# EAGLE schematic LEDs (EAGLE 7.7.0)
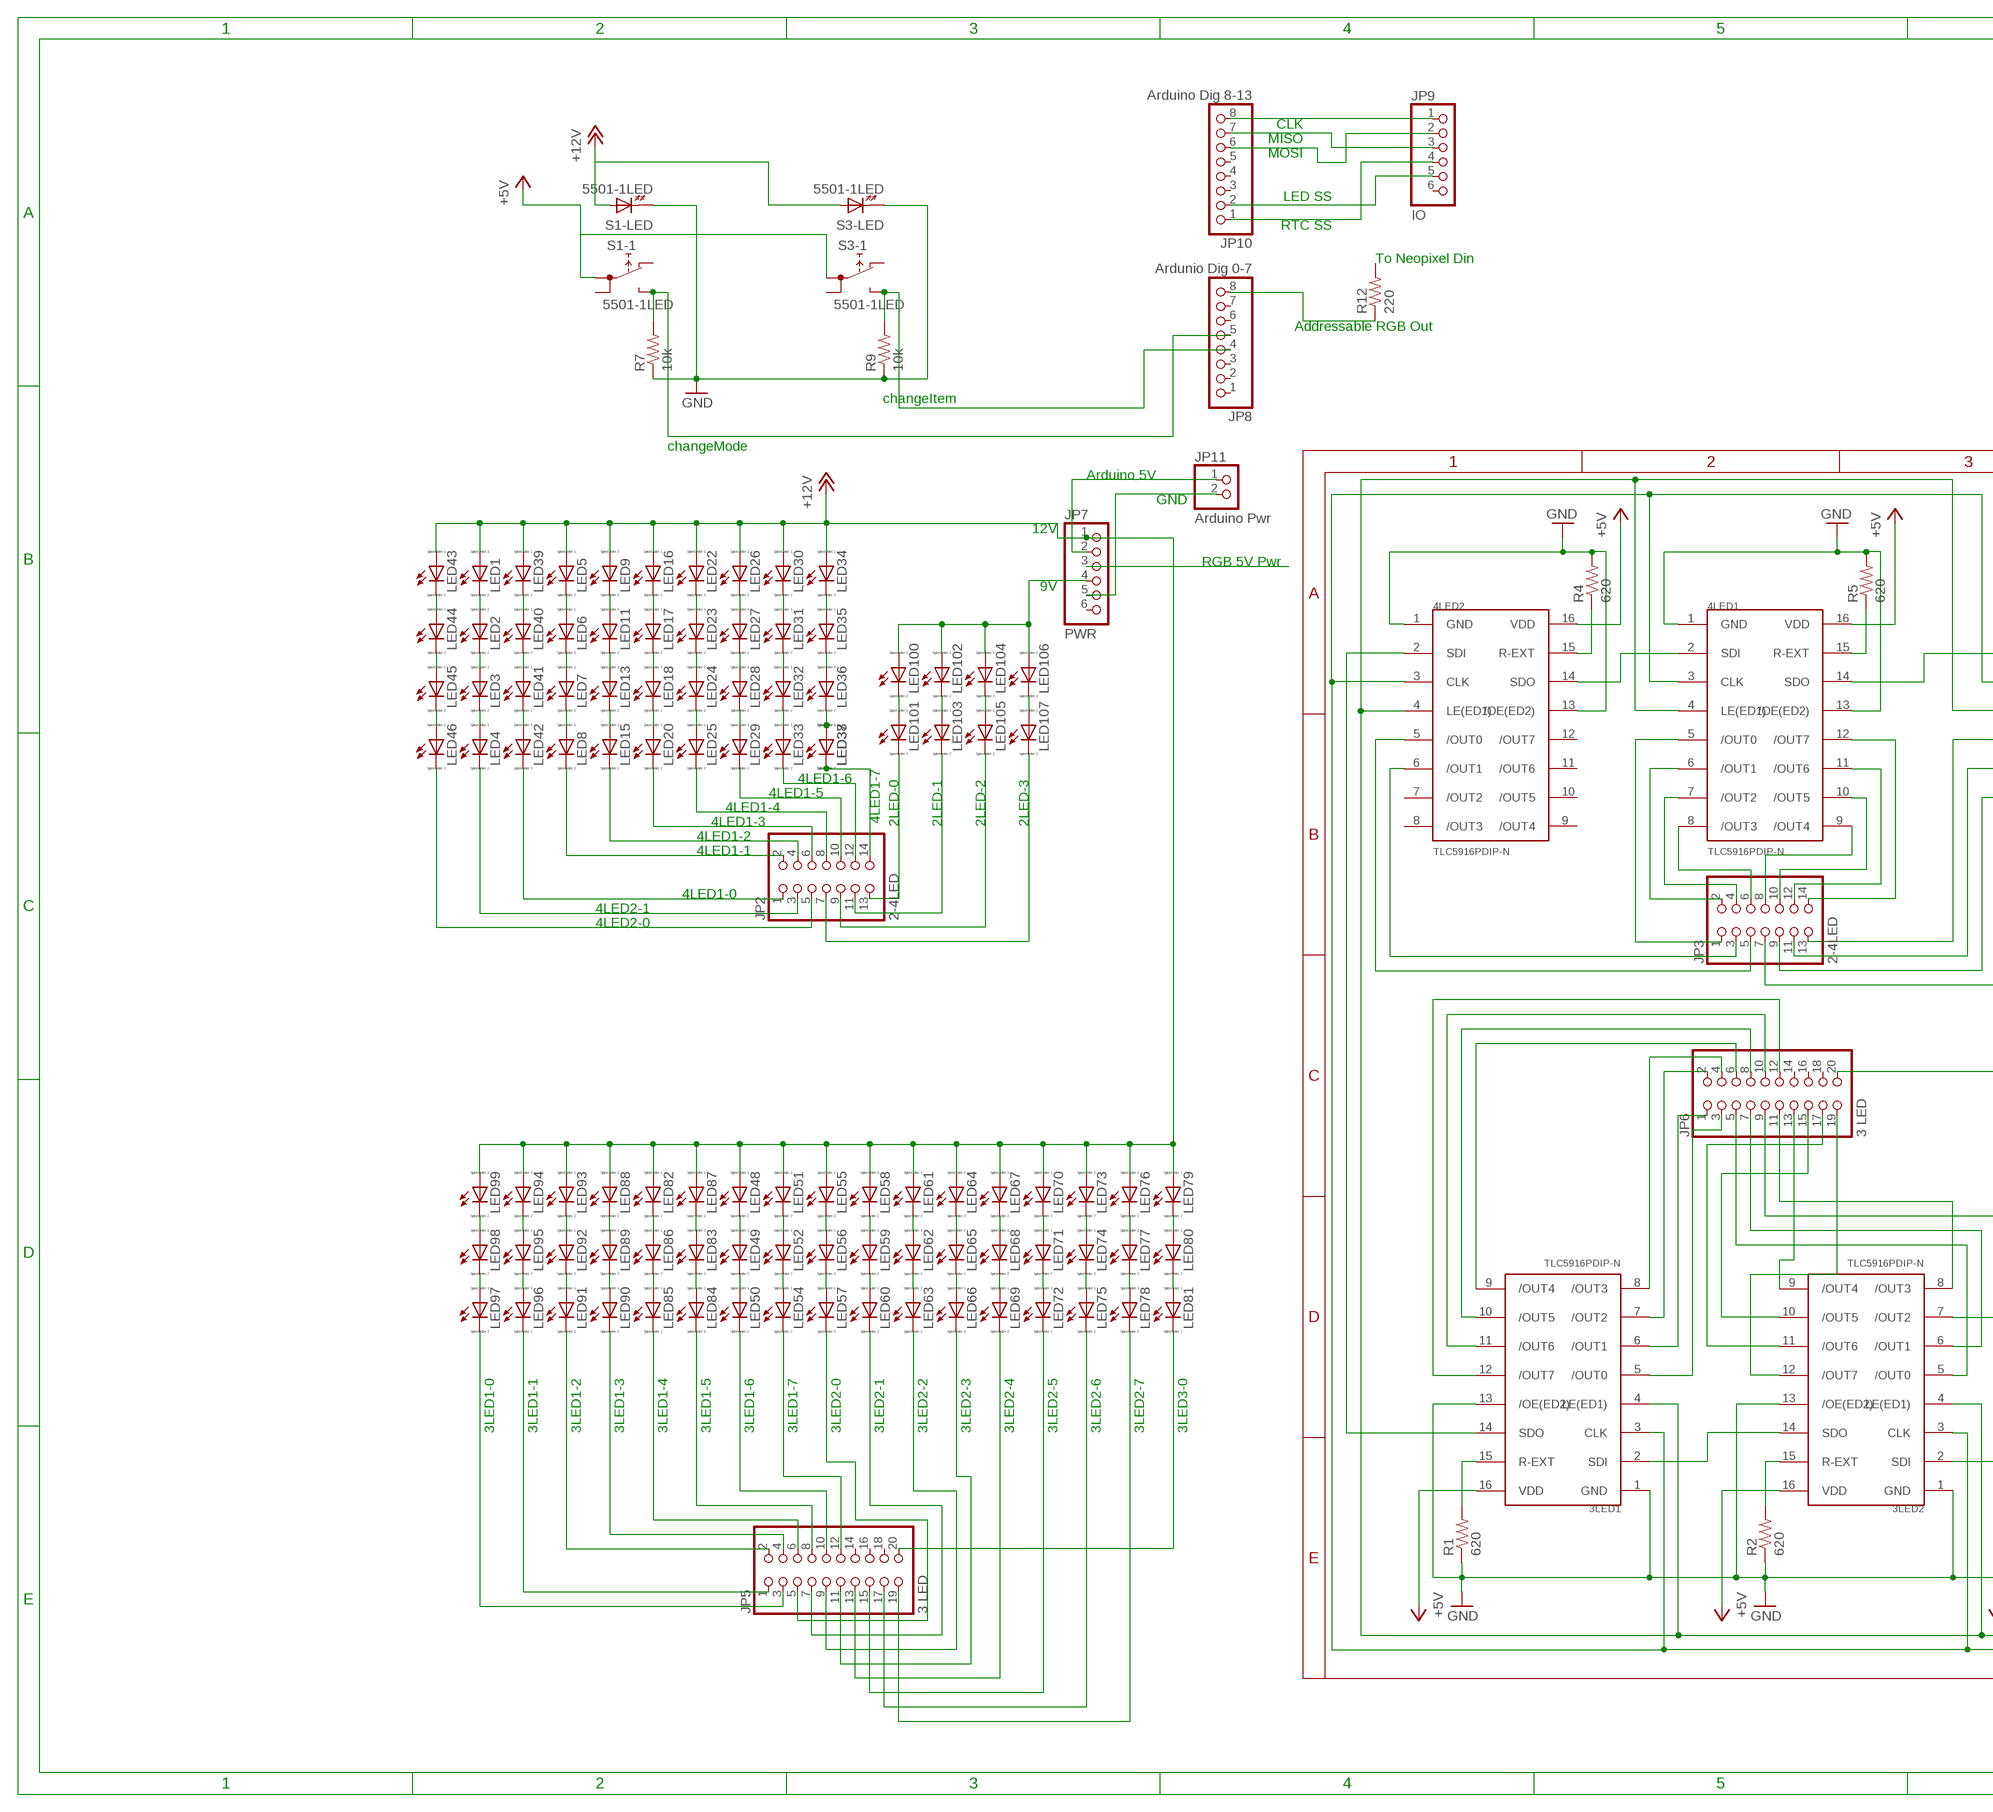
[diagram p0: schematic, sheet 1, part 1 of 2]
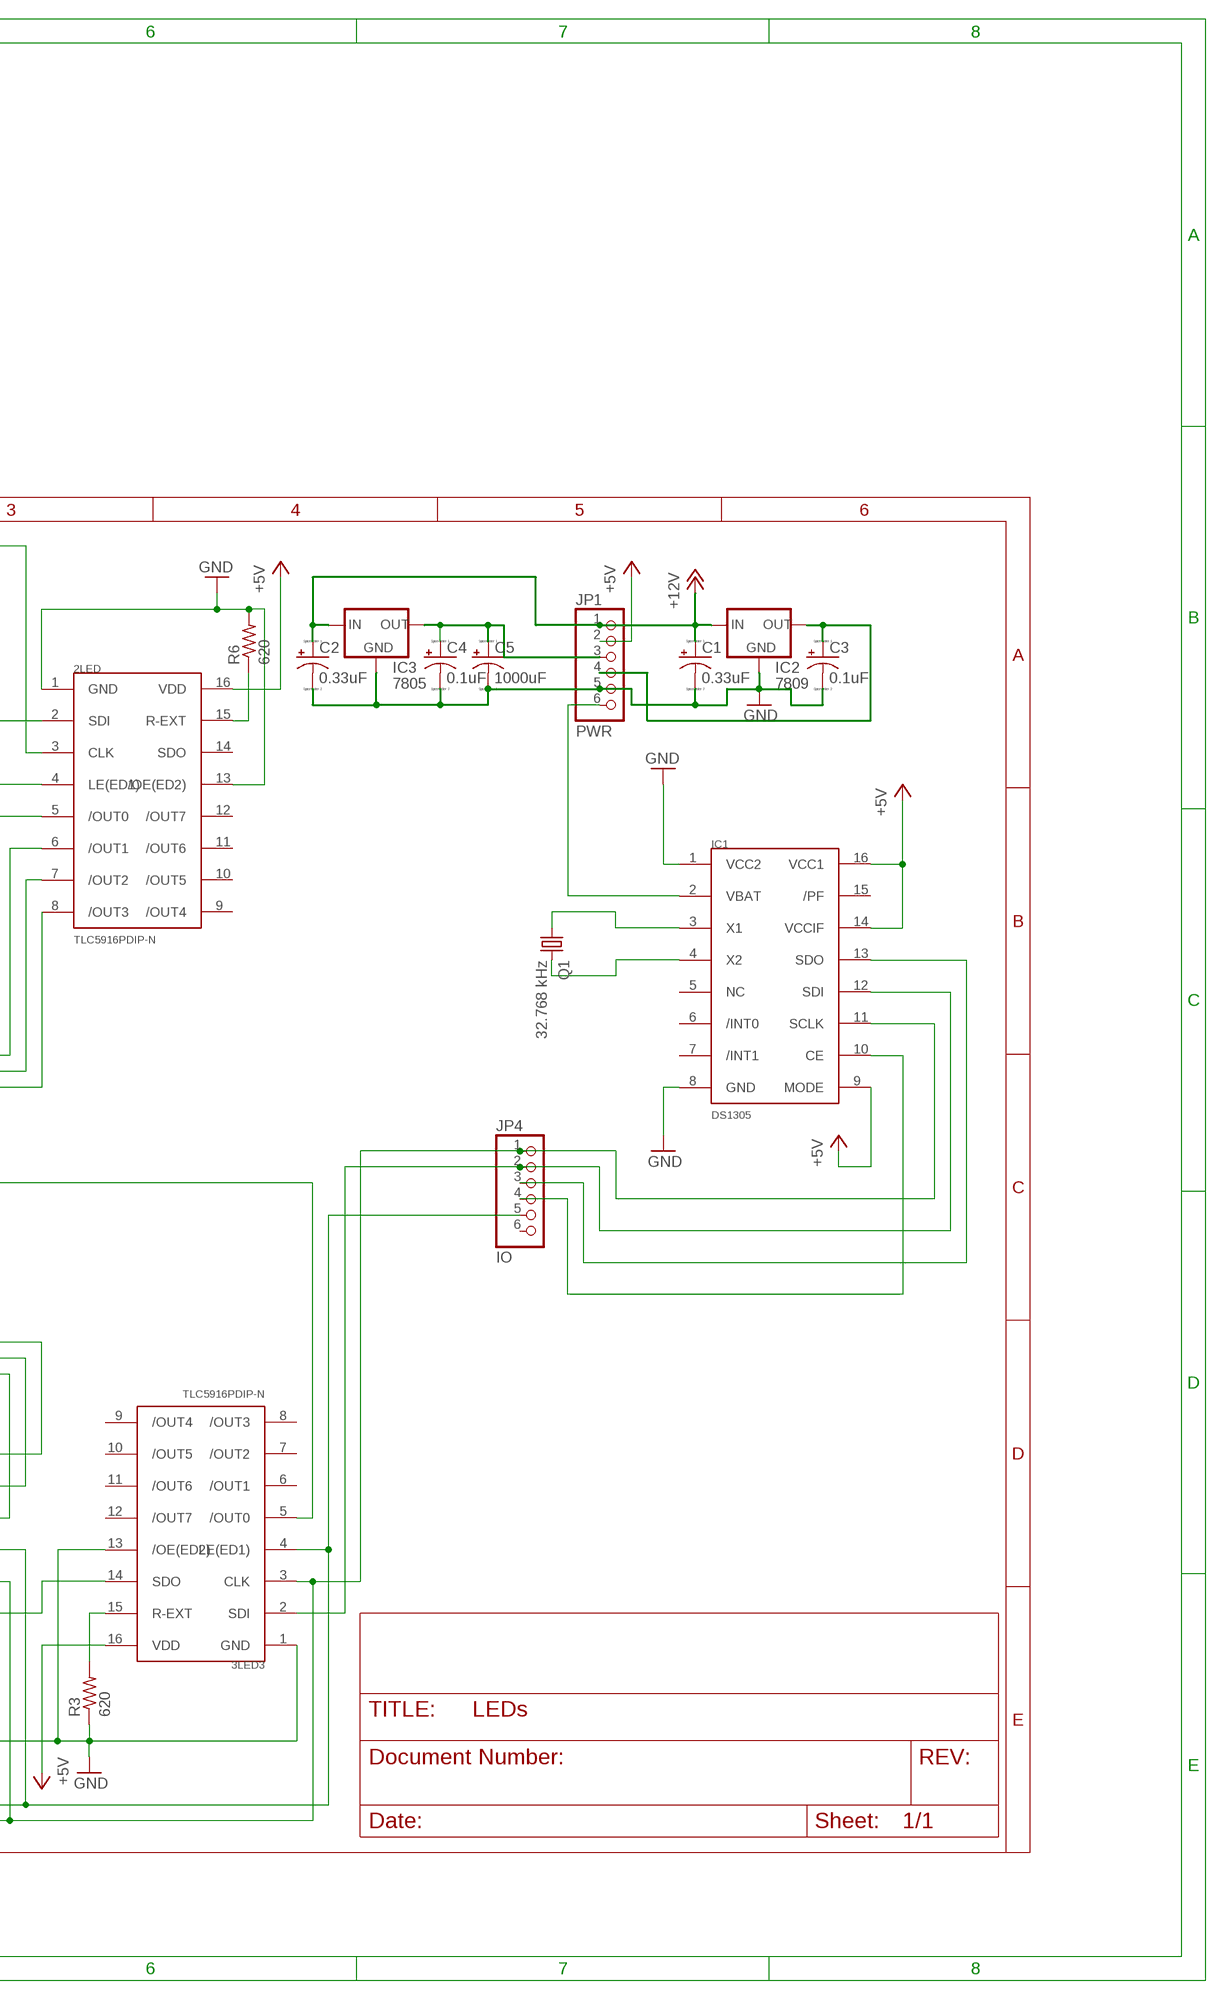
[diagram p1: schematic, sheet 1, part 2 of 2]

## Parts
2LED  TLC5916PDIP-N  [DIL16]
3LED1  TLC5916PDIP-N  [DIL16]
3LED2  TLC5916PDIP-N  [DIL16]
3LED3  TLC5916PDIP-N  [DIL16]
4LED1  TLC5916PDIP-N  [DIL16]
4LED2  TLC5916PDIP-N  [DIL16]
C1  0.33uF  CPOL-USE2-4  [E2-4]
C2  0.33uF  CPOL-USE2-4  [E2-4]
C3  0.1uF  CPOL-USE2-4  [E2-4]
C4  0.1uF  CPOL-USE2-4  [E2-4]
C5  1000uF  CPOL-USE3.5-8  [E3,5-8]
IC1  DS1305  [DIL16]
IC2  7809  78XXL  [78XXL]
IC3  7805  78XXL  [78XXL]
JP1  PWR  PINHD-1X6  [1X06]
JP2  2-4LED  PINHD-2X7  [2X07]
JP3  2-4LED  PINHD-2X7  [2X07]
JP4  IO  PINHD-1X6  [1X06]
JP5  3 LED  PINHD-2X10  [2X10]
JP6  3 LED  PINHD-2X10  [2X10]
JP7  PWR  PINHD-1X6  [1X06]
JP8  Ardunio Dig 0-7  PINHD-1X8  [1X08]
JP9  IO  PINHD-1X6  [1X06]
JP10  Arduino Dig 8-13  PINHD-1X8  [1X08]
JP11  Arduino Pwr  PINHD-1X2  [1X02]
LED1  LED_ELD260  [LED_LD260]
LED2  LED_ELD260  [LED_LD260]
LED3  LED_ELD260  [LED_LD260]
LED4  LED_ELD260  [LED_LD260]
LED5  LED_ELD260  [LED_LD260]
LED6  LED_ELD260  [LED_LD260]
LED7  LED_ELD260  [LED_LD260]
LED8  LED_ELD260  [LED_LD260]
LED9  LED_ELD260  [LED_LD260]
LED11  LED_ELD260  [LED_LD260]
LED13  LED_ELD260  [LED_LD260]
LED15  LED_ELD260  [LED_LD260]
LED16  LED_ELD260  [LED_LD260]
LED17  LED_ELD260  [LED_LD260]
LED18  LED_ELD260  [LED_LD260]
LED20  LED_ELD260  [LED_LD260]
LED22  LED_ELD260  [LED_LD260]
LED23  LED_ELD260  [LED_LD260]
LED24  LED_ELD260  [LED_LD260]
LED25  LED_ELD260  [LED_LD260]
LED26  LED_ELD260  [LED_LD260]
LED27  LED_ELD260  [LED_LD260]
LED28  LED_ELD260  [LED_LD260]
LED29  LED_ELD260  [LED_LD260]
LED30  LED_ELD260  [LED_LD260]
LED31  LED_ELD260  [LED_LD260]
LED32  LED_ELD260  [LED_LD260]
LED33  LED_ELD260  [LED_LD260]
LED34  LED_ELD260  [LED_LD260]
LED35  LED_ELD260  [LED_LD260]
LED36  LED_ELD260  [LED_LD260]
LED37  LED_ELD260  [LED_LD260]
LED38  LED_ELD260  [LED_LD260]
LED39  LED_ELD260  [LED_LD260]
LED40  LED_ELD260  [LED_LD260]
LED41  LED_ELD260  [LED_LD260]
LED42  LED_ELD260  [LED_LD260]
LED43  LED_ELD260  [LED_LD260]
LED44  LED_ELD260  [LED_LD260]
LED45  LED_ELD260  [LED_LD260]
LED46  LED_ELD260  [LED_LD260]
LED48  LED_ELD260  [LED_LD260]
LED49  LED_ELD260  [LED_LD260]
LED50  LED_ELD260  [LED_LD260]
LED51  LED_ELD260  [LED_LD260]
LED52  LED_ELD260  [LED_LD260]
LED54  LED_ELD260  [LED_LD260]
LED55  LED_ELD260  [LED_LD260]
LED56  LED_ELD260  [LED_LD260]
LED57  LED_ELD260  [LED_LD260]
LED58  LED_ELD260  [LED_LD260]
LED59  LED_ELD260  [LED_LD260]
LED60  LED_ELD260  [LED_LD260]
LED61  LED_ELD260  [LED_LD260]
LED62  LED_ELD260  [LED_LD260]
LED63  LED_ELD260  [LED_LD260]
LED64  LED_ELD260  [LED_LD260]
LED65  LED_ELD260  [LED_LD260]
LED66  LED_ELD260  [LED_LD260]
LED67  LED_ELD260  [LED_LD260]
LED68  LED_ELD260  [LED_LD260]
LED69  LED_ELD260  [LED_LD260]
LED70  LED_ELD260  [LED_LD260]
LED71  LED_ELD260  [LED_LD260]
LED72  LED_ELD260  [LED_LD260]
LED73  LED_ELD260  [LED_LD260]
LED74  LED_ELD260  [LED_LD260]
LED75  LED_ELD260  [LED_LD260]
LED76  LED_ELD260  [LED_LD260]
LED77  LED_ELD260  [LED_LD260]
LED78  LED_ELD260  [LED_LD260]
LED79  LED_ELD260  [LED_LD260]
LED80  LED_ELD260  [LED_LD260]
LED81  LED_ELD260  [LED_LD260]
LED82  LED_ELD260  [LED_LD260]
LED83  LED_ELD260  [LED_LD260]
LED84  LED_ELD260  [LED_LD260]
LED85  LED_ELD260  [LED_LD260]
LED86  LED_ELD260  [LED_LD260]
LED87  LED_ELD260  [LED_LD260]
LED88  LED_ELD260  [LED_LD260]
LED89  LED_ELD260  [LED_LD260]
LED90  LED_ELD260  [LED_LD260]
LED91  LED_ELD260  [LED_LD260]
LED92  LED_ELD260  [LED_LD260]
LED93  LED_ELD260  [LED_LD260]
LED94  LED_ELD260  [LED_LD260]
LED95  LED_ELD260  [LED_LD260]
LED96  LED_ELD260  [LED_LD260]
LED97  LED_ELD260  [LED_LD260]
LED98  LED_ELD260  [LED_LD260]
LED99  LED_ELD260  [LED_LD260]
LED100  LED_ELD260  [LED_LD260]
LED101  LED_ELD260  [LED_LD260]
LED102  LED_ELD260  [LED_LD260]
LED103  LED_ELD260  [LED_LD260]
LED104  LED_ELD260  [LED_LD260]
LED105  LED_ELD260  [LED_LD260]
LED106  LED_ELD260  [LED_LD260]
LED107  LED_ELD260  [LED_LD260]
Q1  32.768 kHz  CRYSTALTC26V  [TC26V]
R1  620  R-US_V235/17  [V235/17]
R2  620  R-US_V235/17  [V235/17]
R3  620  R-US_V235/17  [V235/17]
R4  620  R-US_V235/17  [V235/17]
R5  620  R-US_V235/17  [V235/17]
R6  620  R-US_V235/17  [V235/17]
R7  10k  R-US_0204/7  [0204/7]
R9  10k  R-US_0204/7  [0204/7]
R12  220  R-US_0204/7  [0204/7]
S1  5501-1LED  [5501-1LED]
S3  5501-1LED  [5501-1LED]

## Nets
+5V: 2LED.16(VDD) 3LED1.16(VDD) 3LED2.16(VDD) 3LED3.16(VDD) 4LED1.16(VDD) 4LED2.16(VDD) IC1.9(MODE) IC1.14(VCCIF) IC1.16(VCC1) JP1.2 S1.1A(-1:1A) S3.1A(-1:1A)
+12V: C1.+ C2.+ IC2.IN IC3.IN JP1.1 JP7.1 LED1.A LED5.A LED9.A LED16.A LED22.A LED26.A LED30.A LED34.A LED39.A LED43.A LED48.A LED51.A LED55.A LED58.A LED61.A LED64.A LED67.A LED70.A LED73.A LED76.A LED79.A LED82.A LED87.A LED88.A LED93.A LED94.A LED99.A S1.+(-LED:A) S3.+(-LED:A)
GND: 2LED.1(GND) 2LED.13(/OE(ED2)) 3LED1.1(GND) 3LED1.13(/OE(ED2)) 3LED2.1(GND) 3LED2.13(/OE(ED2)) 3LED3.1(GND) 3LED3.13(/OE(ED2)) 4LED1.1(GND) 4LED1.13(/OE(ED2)) 4LED2.1(GND) 4LED2.13(/OE(ED2)) C1.- C2.- C3.- C4.- C5.- IC1.1(VCC2) IC1.8(GND) IC2.GND IC3.GND JP1.5 R1.1 R2.1 R3.1 R4.2 R5.2 R6.2 R7.1 R9.1 S1.-(-LED:K) S3.-(-LED:K)
MISO: IC1.13(SDO) JP4.3
MOSI: 3LED3.2(SDI) IC1.12(SDI) JP4.2
N$1: IC1.3(X1) Q1.1
N$2: IC1.4(X2) Q1.2
N$3: LED95.K(C) LED96.A
N$4: LED94.K(C) LED95.A
N$5: LED92.A LED93.K(C)
N$6: LED91.A LED92.K(C)
N$7: LED100.K(C) LED101.A
N$8: LED102.K(C) LED103.A
N$9: LED36.K(C) LED37.A LED38.A
N$10: JP2.14 LED37.K(C) LED38.K(C)
N$11: LED104.K(C) LED105.A
N$12: LED106.K(C) LED107.A
N$13: LED34.K(C) LED35.A
N$14: LED30.K(C) LED31.A
N$15: LED26.K(C) LED27.A
N$16: LED22.K(C) LED23.A
N$17: LED16.K(C) LED17.A
N$18: LED9.K(C) LED11.A
N$19: LED5.K(C) LED6.A
N$20: LED39.K(C) LED40.A
N$21: LED1.K(C) LED2.A
N$22: LED43.K(C) LED44.A
N$23: LED44.K(C) LED45.A
N$24: LED2.K(C) LED3.A
N$25: LED40.K(C) LED41.A
N$26: LED6.K(C) LED7.A
N$27: LED11.K(C) LED13.A
N$28: LED17.K(C) LED18.A
N$29: LED23.K(C) LED24.A
N$30: LED27.K(C) LED28.A
N$31: LED31.K(C) LED32.A
N$32: LED35.K(C) LED36.A
N$33: LED32.K(C) LED33.A
N$34: LED28.K(C) LED29.A
N$35: LED24.K(C) LED25.A
N$36: LED18.K(C) LED20.A
N$37: LED13.K(C) LED15.A
N$38: LED7.K(C) LED8.A
N$39: LED41.K(C) LED42.A
N$40: LED3.K(C) LED4.A
N$41: LED45.K(C) LED46.A
N$42: C4.+ C5.+ IC3.OUT JP1.3
N$43: LED98.A LED99.K(C)
N$44: LED97.A LED98.K(C)
N$45: LED89.K(C) LED90.A
N$46: LED88.K(C) LED89.A
N$47: LED82.K(C) LED86.A
N$48: LED85.A LED86.K(C)
N$49: LED83.K(C) LED84.A
N$50: LED83.A LED87.K(C)
N$51: LED48.K(C) LED49.A
N$52: LED49.K(C) LED50.A
N$53: LED52.K(C) LED54.A
N$54: LED56.K(C) LED57.A
N$55: LED55.K(C) LED56.A
N$56: LED51.K(C) LED52.A
N$57: LED58.K(C) LED59.A
N$58: LED59.K(C) LED60.A
N$59: LED62.K(C) LED63.A
N$60: LED61.K(C) LED62.A
N$61: LED64.K(C) LED65.A
N$62: LED65.K(C) LED66.A
N$63: LED68.K(C) LED69.A
N$64: LED71.K(C) LED72.A
N$65: LED74.K(C) LED75.A
N$66: LED77.K(C) LED78.A
N$67: LED80.K(C) LED81.A
N$68: LED79.K(C) LED80.A
N$69: LED76.K(C) LED77.A
N$70: LED73.K(C) LED74.A
N$71: LED70.K(C) LED71.A
N$72: LED67.K(C) LED68.A
N$73: C3.+ IC2.OUT JP1.4
N$74: IC1.2(VBAT) JP1.6
N$75: 2LED.5(/OUT0) JP3.13
N$76: 2LED.6(/OUT1) JP3.11
N$77: 2LED.7(/OUT2) JP3.9
N$78: 2LED.8(/OUT3) JP3.7
N$79: 4LED1.12(/OUT7) JP3.14
N$80: 4LED1.11(/OUT6) JP3.12
N$81: 4LED1.10(/OUT5) JP3.10
N$82: 4LED1.9(/OUT4) JP3.8
N$83: 4LED1.8(/OUT3) JP3.6
N$84: 4LED1.7(/OUT2) JP3.4
N$85: 4LED1.6(/OUT1) JP3.2
N$86: 4LED1.5(/OUT0) JP3.1
N$87: 4LED2.6(/OUT1) JP3.3
N$88: 4LED2.5(/OUT0) JP3.5
N$89: 2LED.2(SDI) 4LED1.14(SDO)
N$90: 4LED1.2(SDI) 4LED2.14(SDO)
N$91: 4LED2.15(R-EXT) R4.1
N$92: 4LED1.15(R-EXT) R5.1
N$93: 2LED.15(R-EXT) R6.1
N$94: 2LED.4(LE(ED1)) 3LED1.4(LE(ED1)) 3LED2.4(LE(ED1)) 3LED3.4(LE(ED1)) 4LED1.4(LE(ED1)) 4LED2.4(LE(ED1)) JP4.5
N$95: 3LED1.12(/OUT7) JP6.12
N$96: 3LED1.7(/OUT2) JP6.2
N$97: 3LED1.8(/OUT3) JP6.4
N$98: 3LED1.9(/OUT4) JP6.6
N$99: 3LED1.10(/OUT5) JP6.8
N$100: 3LED1.11(/OUT6) JP6.10
N$101: 3LED3.5(/OUT0) JP6.20
N$102: 3LED1.6(/OUT1) JP6.1
N$103: 3LED1.5(/OUT0) JP6.3
N$104: 3LED2.2(SDI) 3LED3.14(SDO)
N$105: 3LED1.2(SDI) 3LED2.14(SDO)
N$106: 3LED1.14(SDO) 4LED2.2(SDI)
N$107: 3LED3.15(R-EXT) R3.2
N$108: 3LED2.15(R-EXT) R2.2
N$109: 3LED1.15(R-EXT) R1.2
N$110: 3LED2.5(/OUT0) JP6.5
N$111: 3LED2.6(/OUT1) JP6.7
N$112: 3LED2.7(/OUT2) JP6.9
N$113: 3LED2.8(/OUT3) JP6.11
N$114: 3LED2.9(/OUT4) JP6.13
N$115: 3LED2.10(/OUT5) JP6.15
N$116: 3LED2.11(/OUT6) JP6.17
N$117: 3LED2.12(/OUT7) JP6.19
N$118: JP2.13 LED101.K(C)
N$119: JP2.11 LED103.K(C)
N$120: JP2.9 LED105.K(C)
N$121: JP2.7 LED107.K(C)
N$122: JP2.12 LED33.K(C)
N$123: JP2.10 LED29.K(C)
N$124: JP2.8 LED25.K(C)
N$125: JP2.6 LED20.K(C)
N$126: JP2.4 LED15.K(C)
N$127: JP2.2 LED8.K(C)
N$128: JP2.1 LED42.K(C)
N$129: JP7.4 LED100.A LED102.A LED104.A LED106.A
N$130: JP2.3 LED4.K(C)
N$131: JP2.5 LED46.K(C)
N$132: JP5.1 LED96.K(C)
N$133: JP5.3 LED97.K(C)
N$134: JP5.2 LED91.K(C)
N$135: JP5.4 LED90.K(C)
N$136: JP5.6 LED85.K(C)
N$137: JP5.8 LED84.K(C)
N$138: JP5.10 LED50.K(C)
N$139: JP5.12 LED54.K(C)
N$140: JP5.5 LED57.K(C)
N$141: JP5.7 LED60.K(C)
N$142: JP5.9 LED63.K(C)
N$143: JP5.11 LED66.K(C)
N$144: JP5.13 LED69.K(C)
N$145: JP5.15 LED72.K(C)
N$146: JP5.17 LED75.K(C)
N$147: JP5.19 LED78.K(C)
N$148: JP5.20 LED81.K(C)
N$149: JP8.8 R12.1
N$151: JP8.4 R9.2 S3.NO(-1:NO)
N$153: JP8.5 R7.2 S1.NO(-1:NO)
N$154: JP9.1 JP10.8
N$155: JP9.3 JP10.7
N$156: JP9.2 JP10.6
N$157: JP9.4 JP10.1
N$158: JP9.5 JP10.2
N$159: JP7.2 JP11.1
N$160: JP7.5 JP11.2
N$161: JP7.3
SDI_CLK: 2LED.3(CLK) 3LED1.3(CLK) 3LED2.3(CLK) 3LED3.3(CLK) 4LED1.3(CLK) 4LED2.3(CLK) IC1.11(SCLK) JP4.1
SS_RTC: IC1.10(CE) JP4.4
Unconnected: 2LED.9(/OUT4) 2LED.10(/OUT5) 2LED.11(/OUT6) 2LED.12(/OUT7) 2LED.14(SDO) 3LED3.6(/OUT1) 3LED3.7(/OUT2) 3LED3.8(/OUT3) 3LED3.9(/OUT4) 3LED3.10(/OUT5) 3LED3.11(/OUT6) 3LED3.12(/OUT7) 4LED2.7(/OUT2) 4LED2.8(/OUT3) 4LED2.9(/OUT4) 4LED2.10(/OUT5) 4LED2.11(/OUT6) 4LED2.12(/OUT7) IC1.5(NC) IC1.6(/INT0) IC1.7(/INT1) IC1.15(/PF) JP4.6 JP5.14 JP5.16 JP5.18 JP6.14 JP6.16 JP6.18 JP7.6 JP8.1 JP8.2 JP8.3 JP8.6 JP8.7 JP9.6 JP10.3 JP10.4 JP10.5 R12.2 S1.1B(-1:1B) S1.NC(-1:NC) S3.1B(-1:1B) S3.NC(-1:NC)

## Notes on the sheet
- CLK
- MISO
- MOSI
- LED SS
- RTC SS
- To Neopixel Din
- Addressable RGB Out
- changeItem
- changeMode
- Arduino 5V
- GND
- 12V
- RGB 5V Pwr
- 9V
- 4LED1-7
- 4LED1-6
- 4LED1-5
- 4LED1-4
- 4LED1-3 | 2LED-0 | 2LED-1 | 2LED-2 | 2LED-3
- 4LED1-2
- 4LED1-1
- 4LED1-0
- 4LED2-1
- 4LED2-0
- 3LED1-0 | 3LED1-1 | 3LED1-2 | 3LED1-3 | 3LED1-4 | 3LED1-5 | 3LED1-6 | 3LED1-7 | 3LED2-0 | 3LED2-1 | 3LED2-2 | 3LED2-3 | 3LED2-4 | 3LED2-5 | 3LED2-6 | 3LED2-7 | 3LED3-0

## Library data of the parts
2LED 3LED1-3LED3 4LED1 4LED2 = TLC5916:TLC5916: TLC5916 8 Output Constant Current LED Driver. The TLC5916 is designed for LED displays and LED lighting applications with constant-current control and open-load, shorted-load, and overtemperature detection. The TLC5916 contains an 8-bit shift register and data latches, which convert serial input data into parallel output format. At the output stage, eight regulated current ports are designed to provide uniform and constant current for driving LEDs within a wide range of LED Forward Voltage (VF) variations. Used in system design for LED display applications, e.g., LED panels, it provides great flexibility and device performance. Users can adjust the output current from 3 mA to 120 mA per channel through an external resistor, Rext, which gives flexibility in controlling the light intensity of LEDs. The devices are designed for up to 20 V at the output port. The high clock frequency, 30 MHz, also satisfies the system requirements of high-volume data transmission.
C1-C5 = resistor:CPOL-US: POLARIZED CAPACITOR, American symbol
IC1 = dallas-rtc:DS1305: Serial Alarm Real-Time Clock
IC2 IC3 = v-reg:78XXL: VOLTAGE REGULATOR
JP1 JP4 JP7 JP9 = pinhead:PINHD-1X6: PIN HEADER
JP2 JP3 = pinhead:PINHD-2X7: PIN HEADER
JP5 JP6 = pinhead:PINHD-2X10: PIN HEADER
JP8 JP10 = pinhead:PINHD-1X8: PIN HEADER
JP11 = pinhead:PINHD-1X2: PIN HEADER
LED1-LED9 LED11 LED13 LED15-LED18 LED20 LED22-LED46 LED48-LED52 LED54-LED107 = eagle-ltspice:LED_E: LED Source: http://www.osram.convergy.de Source: www.luxeon.com Source: www.kingbright.com; SPICEMODEL: NONE; SPICEPREFIX: D; SPICETYPE: diode
Q1 = crystal:CRYSTAL: CRYSTAL; OC_FARNELL: unknown; OC_NEWARK: unknown
R1-R7 R9 R12 = resistor:R-US_: RESISTOR, American symbol
S1 S3 = switch:55?-1LED: PUSHBUTTON SERIES 5500 SWITCHES 1 LED Source: www.e-switch.com .. 5500.pdf